# EAGLE design Shruthi-Analog-BlipToo12-v01 (EAGLE 5.09)
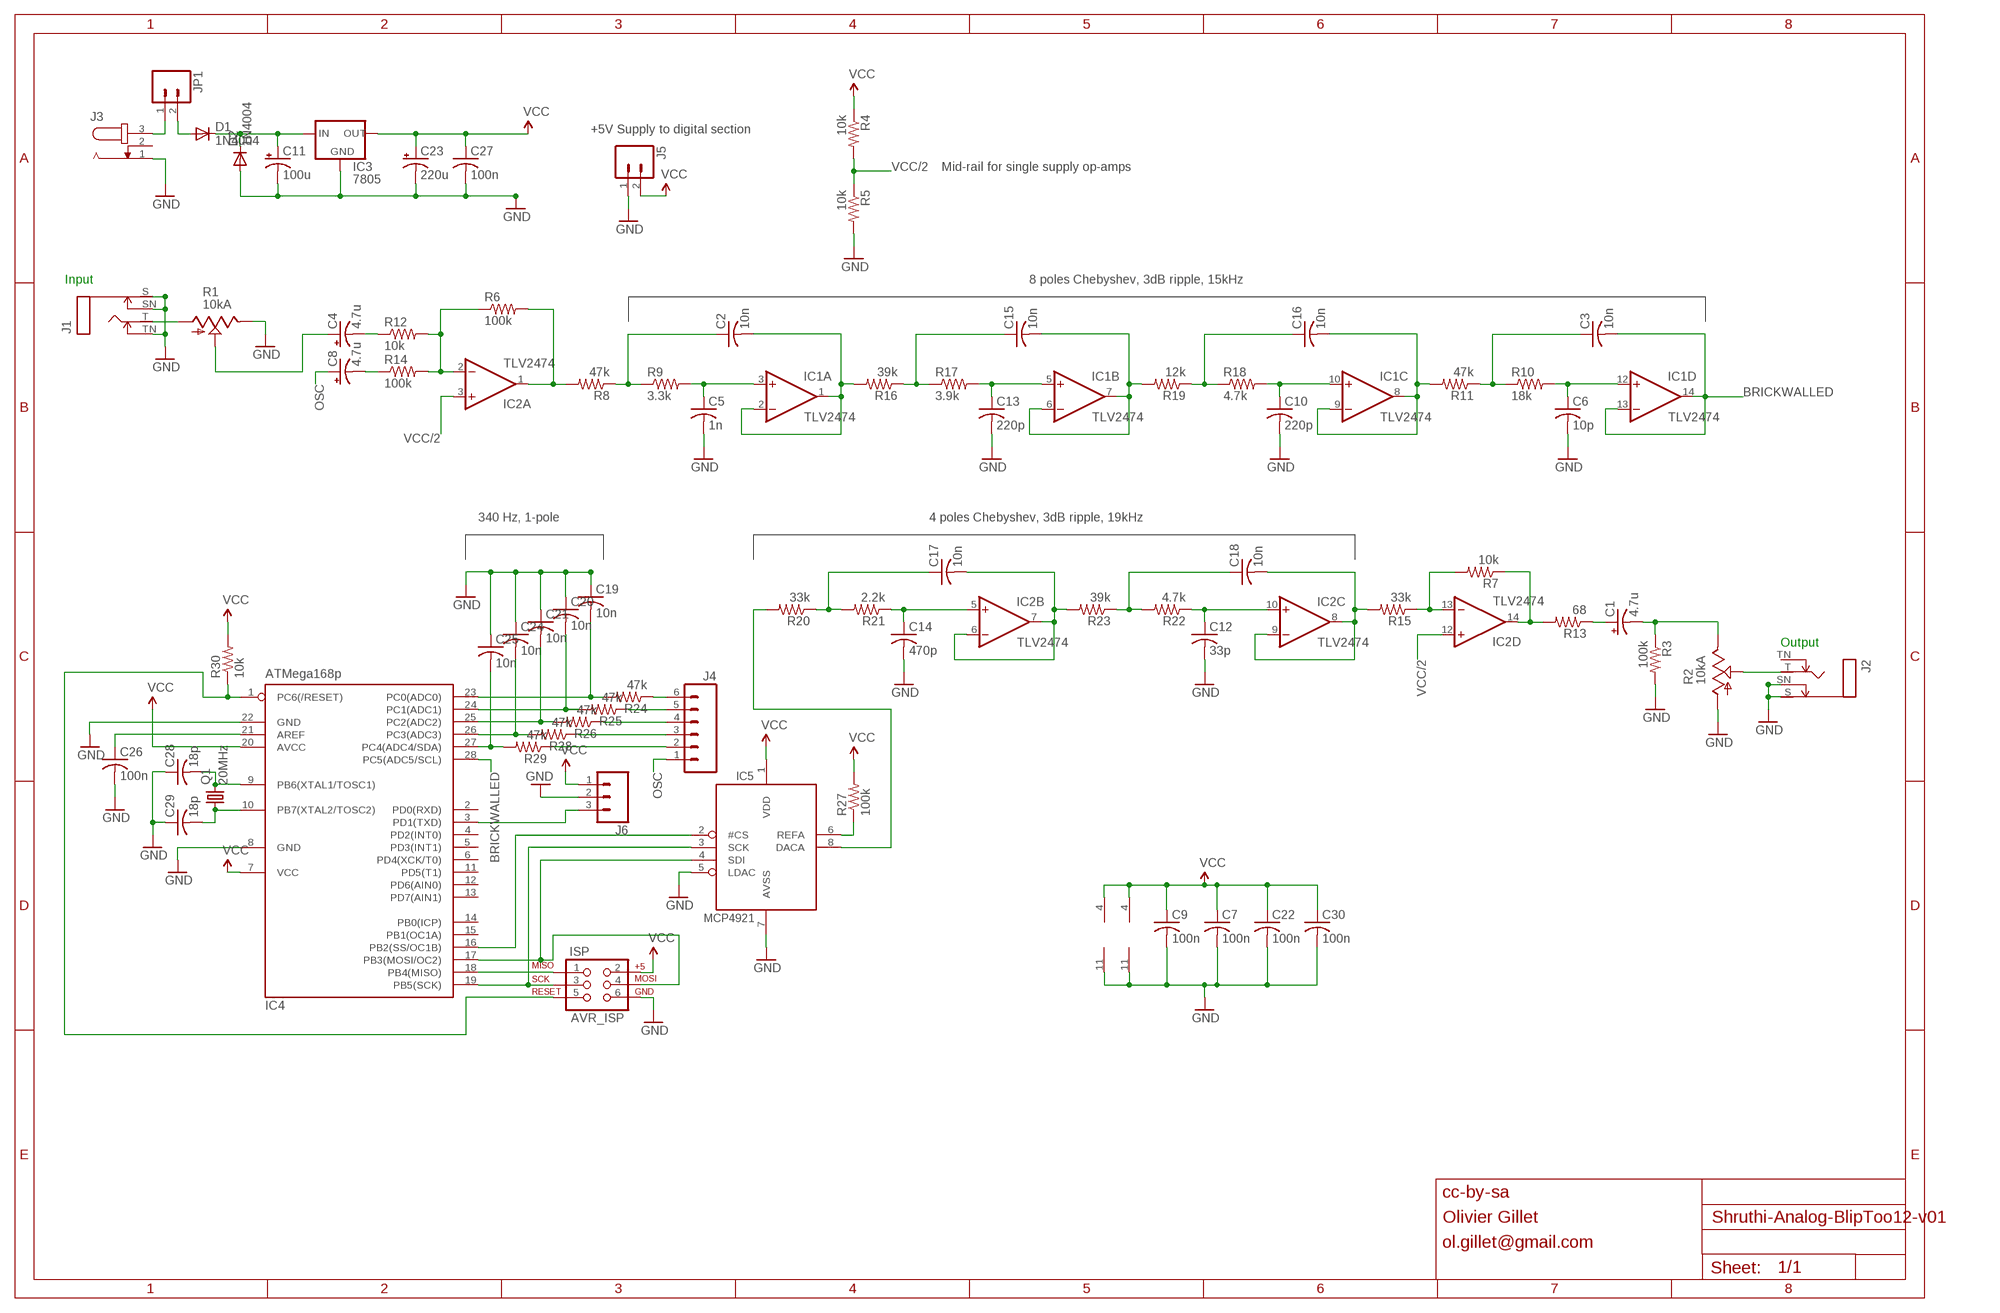
[diagram p0: schematic, sheet 1]

## Parts
C1  4.7u  CPOL-USE2.5-6  [E2,5-6]
C2  10n  C-US050-025X075  [C050-025X075]
C3  10n  C-US050-025X075  [C050-025X075]
C4  4.7u  CPOL-USE2.5-6  [E2,5-6]
C5  1n  C-US025-025X050  [C025-025X050]
C6  10p  C-US025-025X050  [C025-025X050]
C7  100n  C-US025-025X050  [C025-025X050]
C8  4.7u  CPOL-USE2.5-6  [E2,5-6]
C9  100n  C-US025-025X050  [C025-025X050]
C10  220p  C-US025-025X050  [C025-025X050]
C11  100u  CPOL-USE2.5-7  [E2,5-7]
C12  33p  C-US025-025X050  [C025-025X050]
C13  220p  C-US025-025X050  [C025-025X050]
C14  470p  C-US025-025X050  [C025-025X050]
C15  10n  C-US050-025X075  [C050-025X075]
C16  10n  C-US050-025X075  [C050-025X075]
C17  10n  C-US050-025X075  [C050-025X075]
C18  10n  C-US050-025X075  [C050-025X075]
C19  10n  C-US050-025X075  [C050-025X075]
C20  10n  C-US050-025X075  [C050-025X075]
C21  10n  C-US050-025X075  [C050-025X075]
C22  100n  C-US025-025X050  [C025-025X050]
C23  220u  CPOL-USE5-10.5  [E5-10,5]
C24  10n  C-US050-025X075  [C050-025X075]
C25  10n  C-US050-025X075  [C050-025X075]
C26  100n  C-US025-025X050  [C025-025X050]
C27  100n  C-US025-025X050  [C025-025X050]
C28  18p  C-US025-024X044  [C025-024X044]
C29  18p  C-US025-024X044  [C025-024X044]
C30  100n  C-US025-024X044  [C025-024X044]
D1  1N4004  [DO41-10]
D2  1N4004  [DO41-10]
IC1  TLV2474  TL084P  [DIL14]
IC2  TLV2474  TL084P  [DIL14]
IC3  7805  78XXS  [78XXS]
IC4  ATMega168p  MEGA8-P  [DIL28-3]
IC5  MCP4921  [DIL08]
ISP  AVR_ISP  AVR_SPI_PRG_6PTH  [2X3]
J1  MONOSWS  [NMJ4HC-S]
J2  MONOSWS  [NMJ4HC-S]
J3  JACK-PLUG  [SPC4078_LARGER_HOLES]
J4  M06SIP  [1X06]
J5  M02PTH  [1X02]
J6  M03PTH  [1X03]
JP1  M02  [1X02_LONGPADS]
Q1  20MHz  CRYSTALHC49U-V  [HC49U-V]
R1  10kA  POT_USCABLED  [CABLE_POT_6MM]
R2  10kA  POT_USCABLED  [CABLE_POT_6MM]
R3  100k  R-US_0204/7  [0204/7]
R4  10k  R-US_0204/7  [0204/7]
R5  10k  R-US_0204/7  [0204/7]
R6  100k  R-US_0204/7  [0204/7]
R7  10k  R-US_0204/7  [0204/7]
R8  47k  R-US_0204/7  [0204/7]
R9  3.3k  R-US_0204/7  [0204/7]
R10  18k  R-US_0204/7  [0204/7]
R11  47k  R-US_0204/7  [0204/7]
R12  10k  R-US_0204/7  [0204/7]
R13  68  R-US_0204/7  [0204/7]
R14  100k  R-US_0204/7  [0204/7]
R15  33k  R-US_0204/7  [0204/7]
R16  39k  R-US_0204/7  [0204/7]
R17  3.9k  R-US_0204/7  [0204/7]
R18  4.7k  R-US_0204/7  [0204/7]
R19  12k  R-US_0204/7  [0204/7]
R20  33k  R-US_0204/7  [0204/7]
R21  2.2k  R-US_0204/7  [0204/7]
R22  4.7k  R-US_0204/7  [0204/7]
R23  39k  R-US_0204/7  [0204/7]
R24  47k  R-US_0204/7  [0204/7]
R25  47k  R-US_0204/7  [0204/7]
R26  47k  R-US_0204/7  [0204/7]
R27  100k  R-US_0204/7  [0204/7]
R28  47k  R-US_0204/7  [0204/7]
R29  47k  R-US_0204/7  [0204/7]
R30  10k  R-US_0204/7  [0204/7]

## Nets
BRICKWALLED: C3.2 IC1.13(D:-IN) IC1.14(D:OUT) IC4.28(PC5(ADC5/SCL))
GND: C5.2 C6.2 C7.2 C9.2 C10.2 C11.- C12.2 C13.2 C14.2 C19.1 C20.1 C21.1 C22.2 C23.- C24.1 C25.1 C26.2 C27.2 C28.1 C29.1 C30.2 D2.A IC1.11(P:V-) IC2.11(P:V-) IC3.GND IC4.8(GND) IC4.22(GND) IC5.5(LDAC) IC5.7(AVSS) ISP.6 J1.S J1.SN J1.TN J2.S J2.SN J3.1 J5.1 J6.2 R1.E R2.A R3.2 R5.2
N$1: C5.1 IC1.3(A:+IN) R9.2
N$2: C2.1 R8.1 R9.1
N$3: J3.3 JP1.1
N$4: C11.+ D1.C D2.C IC3.IN
N$5: C2.2 IC1.1(A:OUT) IC1.2(A:-IN) R16.2
N$6: C13.1 IC1.5(B:+IN) R17.2
N$7: C15.1 R16.1 R17.1
N$8: C15.2 IC1.6(B:-IN) IC1.7(B:OUT) R19.2
N$9: C10.1 IC1.10(C:+IN) R18.2
N$10: C16.1 R18.1 R19.1
N$11: C16.2 IC1.8(C:OUT) IC1.9(C:-IN) R11.2
N$12: C6.1 IC1.12(D:+IN) R10.2
N$13: C3.1 R10.1 R11.1
N$14: IC4.1(PC6(/RESET)) ISP.5 R30.1
N$16: C26.1 IC4.21(AREF)
N$18: IC4.18(PB4(MISO)) ISP.1
N$19: IC4.19(PB5(SCK)) IC5.3(SCK) ISP.3
N$20: IC5.6(REFA) R27.1
N$21: C4.+ R1.S
N$22: IC4.17(PB3(MOSI/OC2)) IC5.4(SDI) ISP.4
N$23: J1.T R1.A
N$24: IC4.16(PB2(SS/OC1B)) IC5.2(#CS)
N$25: C17.1 R20.1 R21.2
N$26: C4.- R12.1
N$27: C14.1 IC2.5(B:+IN) R21.1
N$28: C17.2 IC2.6(B:-IN) IC2.7(B:OUT) R23.2
N$29: J4.2 R29.1
N$30: C18.1 R22.2 R23.1
N$31: C12.1 IC2.10(C:+IN) R22.1
N$32: C18.2 IC2.8(C:OUT) IC2.9(C:-IN) R15.2
N$33: IC5.8(DACA) R20.2
N$34: C1.- R2.E R3.1
N$35: C8.- R14.1
N$36: IC2.13(D:-IN) R7.2 R15.1
N$37: IC2.14(D:OUT) R7.1 R13.2
N$38: C1.+ R13.1
N$39: IC4.3(PD1(TXD)) J6.3
N$40: IC2.2(A:-IN) R6.1 R12.2 R14.2
N$41: J2.T R2.S
N$42: IC2.1(A:OUT) R6.2 R8.2
N$43: J4.3 R28.1
N$44: J4.4 R26.1
N$45: J4.5 R25.1
N$46: J4.6 R24.1
N$47: C25.2 IC4.27(PC4(ADC4/SDA)) R29.2
N$48: C24.2 IC4.26(PC3(ADC3)) R28.2
N$49: C21.2 IC4.25(PC2(ADC2)) R26.2
N$50: C20.2 IC4.24(PC1(ADC1)) R25.2
N$51: C19.2 IC4.23(PC0(ADC0)) R24.2
N$59: D1.A JP1.2
N$82: C29.2 IC4.10(PB7(XTAL2/TOSC2)) Q1.1
N$83: C28.2 IC4.9(PB6(XTAL1/TOSC1)) Q1.2
OSC: C8.+ J4.1
VCC: C7.1 C9.1 C22.1 C23.+ C27.1 C30.1 IC1.4(P:V+) IC2.4(P:V+) IC3.OUT IC4.7(VCC) IC4.20(AVCC) IC5.1(VDD) ISP.2 J5.2 J6.1 R4.1 R27.2 R30.2
VCC/2: IC2.3(A:+IN) IC2.12(D:+IN) R4.2 R5.1
Unconnected: IC4.2(PD0(RXD)) IC4.4(PD2(INT0)) IC4.5(PD3(INT1)) IC4.6(PD4(XCK/T0)) IC4.11(PD5(T1)) IC4.12(PD6(AIN0)) IC4.13(PD7(AIN1)) IC4.14(PB0(ICP)) IC4.15(PB1(OC1A)) J2.TN J3.2

## Notes on the sheet
- +5V Supply to digital section
- Mid-rail for single supply op-amps
- Input | 8 poles Chebyshev, 3dB ripple, 15kHz
- 340 Hz, 1-pole | 4 poles Chebyshev, 3dB ripple, 19kHz
- Output
- cc-by-sa
- Olivier Gillet
- ol.gillet@gmail.com

## Library data of the parts
C1 C4 C8 C11 C23 = rcl:CPOL-US: POLARIZED CAPACITOR, American symbol
C2 C3 C5-C7 C9 C10 C12-C22 C24-C30 = rcl:C-US: CAPACITOR, American symbol
D1 D2 = diode:1N4004: DIODE general purpose rectifier, 1 A
IC1 IC2 = linear:TL084: OP AMP
IC3 = v-reg:78XXS: VOLTAGE REGULATOR
IC4 = atmel:MEGA8-P: MICROCONTROLLER 8 Kbytes FLASH, 1 kbytes SRAM, 512 bytes EEPROM, USART, 4-channel 10 bit ADC, 2-channel 8 bit ADC Pin compatible with Atmega48, ATMega88, ATMega168 Source: avr.lbr
IC5 = adafruit:MCP4921
ISP = SparkFun:AVR_SPI_PRG_6: AVR ISP 6 Pin This is the reduced ISP connector for AVR programming. Common on Arduino. This footprint will take up less PCB space and can be used with a 10-pin to 6-pin adapter such as SKU: BOB-08508
J1 J2 = gm-jacks:MONOSW
J3 = con-jack2:JACK-PLUG: DC POWER JACK Power Jack, DC, Right Angle, Through Hole, Rated 5A at 16VDC, PC Terminals Distributor: Farnell (www.Farnell.de) Drawing: 84N1161.pdf / 84N1162.pdf Manufacturer: SPC Technology (www.spctechnology.com) Type: SPC4077 / SPC 4078
J4 = SparkFun:M06: Header 6 Standard 6-pin 0.1" header. Use with straight break away headers (SKU : PRT-00116), right angle break away headers (PRT-00553), swiss pins (PRT-00743), machine pins (PRT-00117), and female headers (PRT-00115). Molex polarized connector foot print use with SKU : PRT-08094 with associated crimp pins and housings. NOTES ON THE VARIANTS LOCK and LOCK_LONGPADS... This footprint was designed to help hold the alignment of a through-hole component (i.e. 6-pin header) while soldering it into place. You may notice that each hole has been shifted either up or down by 0.005 of an inch from it's more standard position (which is a perfectly straight line). This slight alteration caused the pins (the squares in the middle) to touch the edges of the holes. Because they are alternating, it causes a "brace" to hold the component in place. 0.005 has proven to be the perfect amount of "off-center" position when using our standard breakaway headers. Although looks a little odd when you look at the bare footprint, once you have a header in there, the alteration is very hard to notice. Also, if you push a header all the way into place, it is covered up entirely on the bottom side. This idea of altering the position of holes to aid alignment will be further integrated into the Sparkfun Library for other footprints. It can help hold any component with 3 or more connection pins.
J5 JP1 = SparkFun:M02: Header 2 Standard 2-pin 0.1" header. Use with straight break away headers (SKU : PRT-00116), right angle break away headers (PRT-00553), swiss pins (PRT-00743), machine pins (PRT-00117), and female headers (PRT-00115). Molex polarized connector foot print use with SKU : PRT-08233 with associated crimp pins and housings.
J6 = SparkFun:M03: Header 3 Standard 3-pin 0.1" header. Use with straight break away headers (SKU : PRT-00116), right angle break away headers (PRT-00553), swiss pins (PRT-00743), machine pins (PRT-00117), and female headers (PRT-00115). Molex polarized connector foot print use with SKU : PRT-08232 with associated crimp pins and housings.
Q1 = crystal:CRYSTAL: CRYSTAL
R1 R2 = pot-cable:POT_US
R3-R30 = rcl:R-US_: RESISTOR, American symbol

## Board
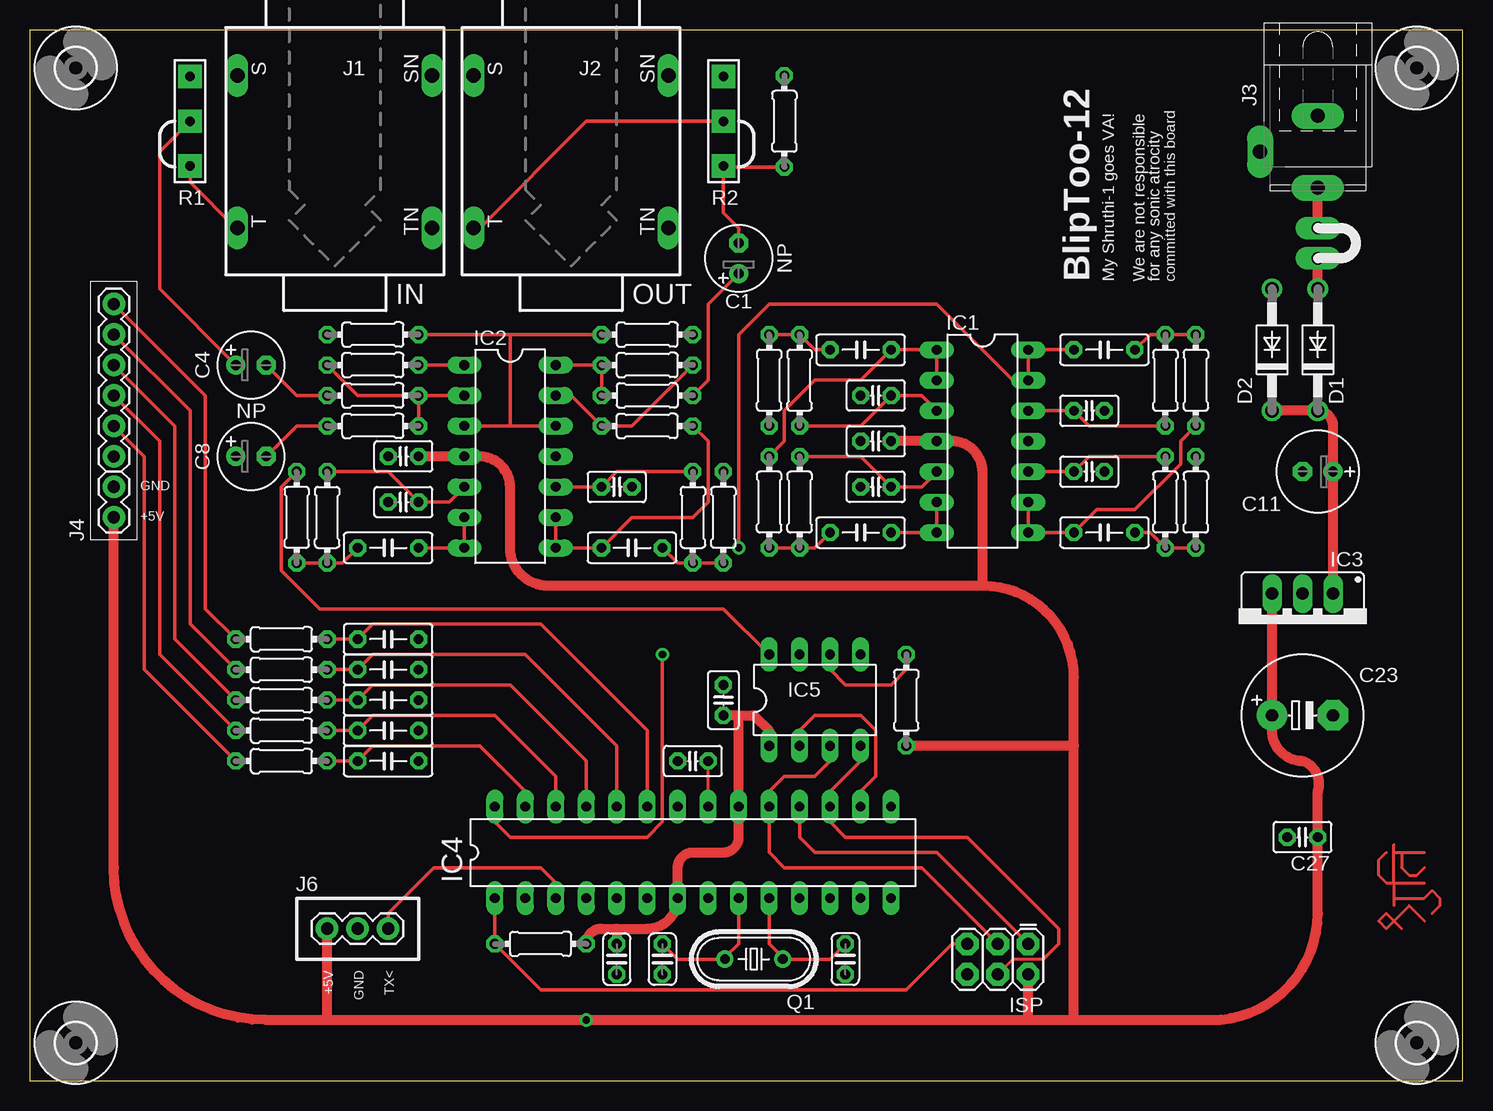
[diagram p1: board, top side]
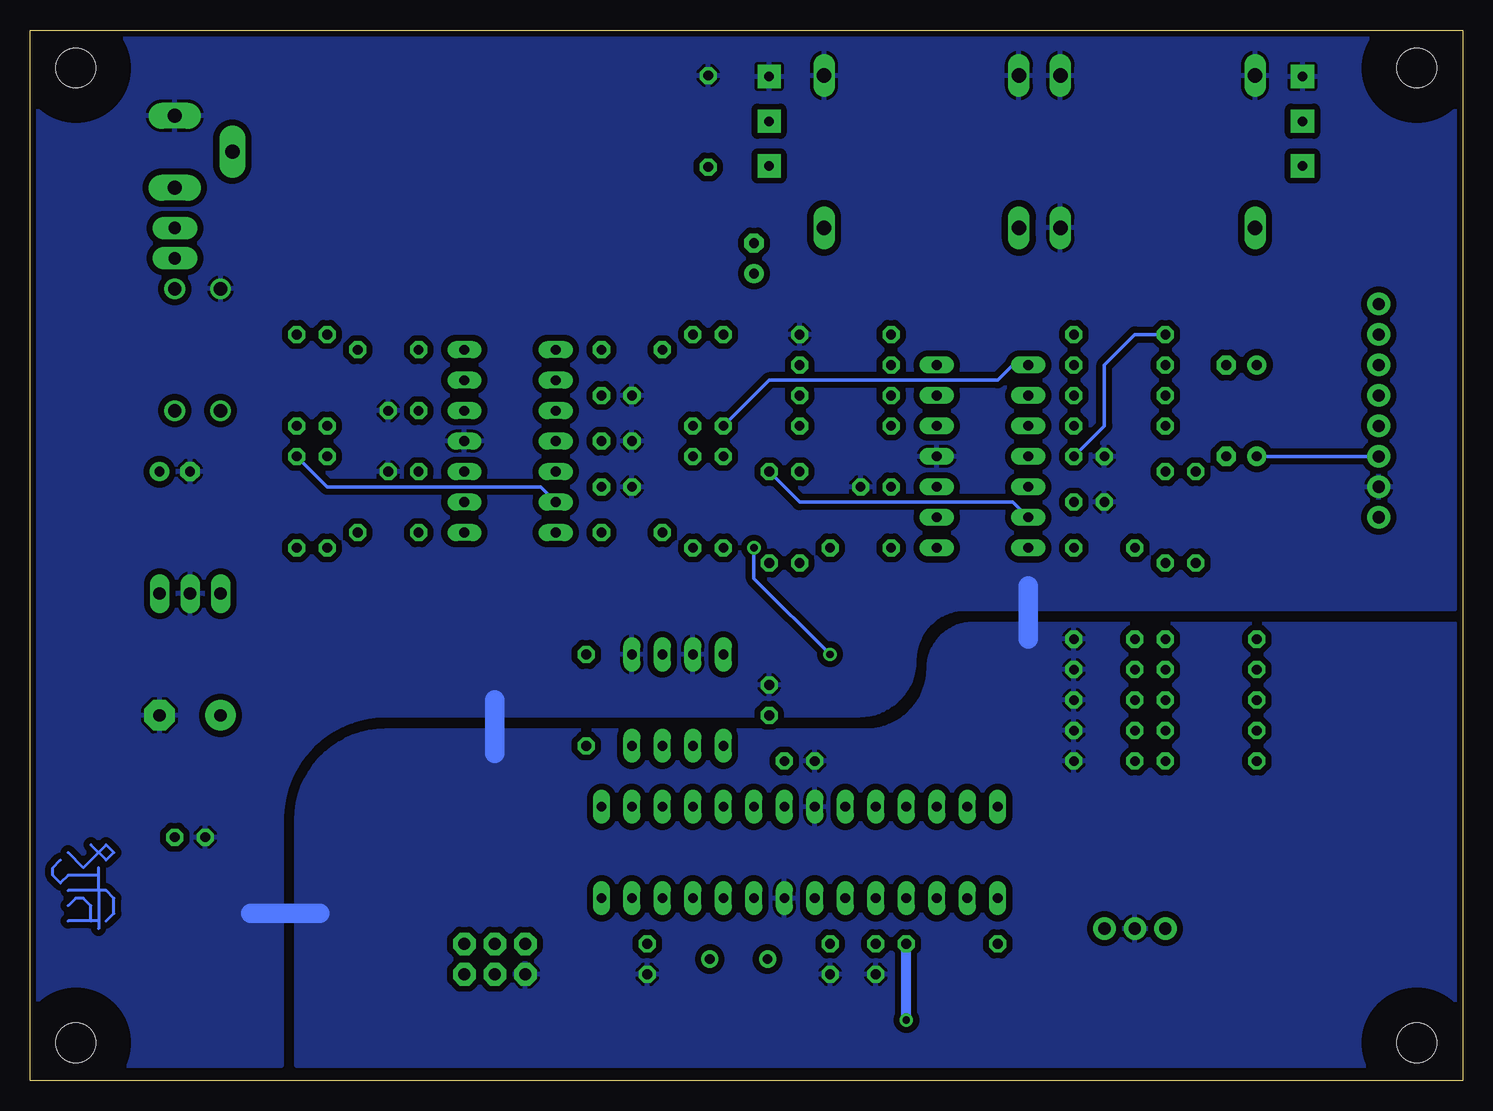
[diagram p2: board, bottom side, seen from below]

Size 119.38 x 87.62 mm. Coordinates in mm from the lower left corner, seen from the top.
Outline: 0,0 119.38,0 119.38,87.62 0,87.62 0,0
Copper layers (1*16): Top 0.035mm / dielectric 1.5mm / Bottom 0.035mm
Design rules "SparkFun": minimum track width 8mil, minimum drill 20mil, track to track 8mil, track to pad 8mil, pad to pad 8mil, via to via 8mil, smd to smd 8mil, copper to edge 10mil, drill to drill 8mil, minimum pad ring 12mil, minimum via ring 10mil, stop-mask expansion 4mil, vias tented up to drill 25mil, thermal gap 10mil

### Footprints (pad centres in the part's own frame; a part is rotated, then mirrored left to right if it is on the bottom)
E2,5-6 = drill 0.813 pad 1.6 round: + -1.27,0 | drill 0.813 pad 1.6 octagon: - 1.27,0
C050-025X075 = drill 0.813 octagon: 1 -2.54,0; 2 2.54,0
C025-025X050 = drill 0.813 octagon: 1 -1.27,0; 2 1.27,0
E2,5-7 = drill 0.813 pad 1.6 round: + -1.27,0 | drill 0.813 pad 1.6 octagon: - 1.27,0
E5-10,5 = drill 1.016 pad 2.54 round: + -2.54,0 | drill 1.016 pad 2.54 octagon: - 2.54,0
C025-024X044 = drill 0.813 octagon: 1 -1.27,0; 2 1.27,0
DO41-10 = drill 1.118 round: A 5.08,0; C -5.08,0
DIL14 = drill 0.813 long: 1 -7.62,-3.81; 2 -5.08,-3.81; 3 -2.54,-3.81; 4 0,-3.81; 5 2.54,-3.81; 6 5.08,-3.81; 7 7.62,-3.81; 8 7.62,3.81; 9 5.08,3.81; 10 2.54,3.81; 11 0,3.81; 12 -2.54,3.81; 13 -5.08,3.81; 14 -7.62,3.81
78XXS = drill 1.016 long: GND 0,-2.54; IN -2.54,-2.54; OUT 2.54,-2.54
DIL28-3 = drill 0.813 long: 1 -16.51,-3.81; 2 -13.97,-3.81; 3 -11.43,-3.81; 4 -8.89,-3.81; 5 -6.35,-3.81; 6 -3.81,-3.81; 7 -1.27,-3.81; 8 1.27,-3.81; 9 3.81,-3.81; 10 6.35,-3.81; 11 8.89,-3.81; 12 11.43,-3.81; 13 13.97,-3.81; 14 16.51,-3.81; 15 16.51,3.81; 16 13.97,3.81; 17 11.43,3.81; 18 8.89,3.81; 19 6.35,3.81; 20 3.81,3.81; 21 1.27,3.81; 22 -1.27,3.81; 23 -3.81,3.81; 24 -6.35,3.81; 25 -8.89,3.81; 26 -11.43,3.81; 27 -13.97,3.81; 28 -16.51,3.81
DIL08 = drill 0.813 long: 1 -3.81,-3.81; 2 -1.27,-3.81; 3 1.27,-3.81; 4 3.81,-3.81; 5 3.81,3.81; 6 1.27,3.81; 7 -1.27,3.81; 8 -3.81,3.81
2X3 = drill 1.016 pad 1.88 octagon: 1 0,0; 2 0,2.54; 3 2.54,0; 4 2.54,2.54; 5 5.08,0; 6 5.08,2.54
NMJ4HC-S = drill 1.2 long: S 5.08,8.115; SN 5.08,-8.115; T -7.62,8.115; TN -7.62,-8.115
SPC4078_LARGER_HOLES = drill 1.2 pad 2.184 long: 1 -3,0; 2 0,-4.8; 3 3,0
1X06 = drill 1.016 pad 1.88 round: 1 0,0; 2 2.54,0; 3 5.08,0; 4 7.62,0; 5 10.16,0; 6 12.7,0
1X02 = drill 1.016 pad 1.88 round: 1 0,0; 2 2.54,0
1X03 = drill 1.016 pad 1.88 round: 1 0,0; 2 2.54,0; 3 5.08,0
1X02_LONGPADS = drill 1.016 pad 1.88 long: 1 0,0; 2 2.54,0
HC49U-V = drill 0.813 round: 1 -2.413,0; 2 2.413,0
CABLE_POT_6MM = drill 0.8 pad 1.93 square: A -3.73,0; E 3.73,0; S 0,0
0204/7 = drill 0.813 octagon: 1 -3.81,0; 2 3.81,0
3,3 = hole 3.3: 0,0

### Placement (x,y rotation side)
C1  59.05,68.58 90 top
C2  69.22,60.96 0 top
C3  89.53,60.96 180 top
C4  18.41,59.69 0 top
C5  70.48,57.15 180 top
C6  88.27,55.88 0 top
C7  70.48,53.34 180 top
C8  18.41,52.07 0 top
C9  31.11,52.07 180 top
C10  88.27,50.8 0 top
C11  107.31,50.8 180 top
C12  48.89,49.53 0 top
C13  70.48,49.53 180 top
C14  31.11,48.26 180 top
C15  69.22,45.72 0 top
C16  89.53,45.72 180 top
C17  29.84,44.45 0 top
C18  50.16,44.45 180 top
C19  29.84,36.83 180 top
C20  29.84,34.29 180 top
C21  29.84,31.75 180 top
C22  57.78,31.75 90 top
C23  106.05,30.48 0 top
C24  29.84,29.21 180 top
C25  29.84,26.67 180 top
C26  55.24,26.67 180 top
C27  106.05,20.32 180 top
C28  52.7,10.16 90 top
C29  67.95,10.16 90 top
C30  48.89,10.16 270 top
D1  107.31,60.96 90 top
D2  103.5,60.96 90 top
IC1  79.38,53.34 270 top
IC2  40.01,52.07 270 top
IC3  106.05,38.1 180 top
IC4  55.24,19.05 0 top
IC5  65.41,31.75 0 top
ISP  83.19,11.43 180 top
J1  25.4,78.74 90 top
J2  45.09,78.74 90 top
J3  107.31,77.47 270 top
J4  6.99,52.07 90 top
J5  6.99,49.53 270 top
J6  24.77,12.7 0 top
JP1  107.31,71.12 270 top
Q1  60.33,10.16 180 top
R1  13.34,80.01 90 top
R2  57.78,80.01 270 top
R3  62.87,80.01 90 top
R4  28.57,62.23 0 top
R5  51.44,62.23 0 top
R6  28.57,59.69 0 top
R7  51.44,59.69 0 top
R8  61.59,58.42 270 top
R9  64.14,58.42 270 top
R10  94.61,58.42 270 top
R11  97.16,58.42 270 top
R12  28.57,57.15 0 top
R13  51.44,57.15 180 top
R14  28.57,54.61 0 top
R15  51.44,54.61 0 top
R16  61.59,48.26 90 top
R17  64.14,48.26 90 top
R18  94.61,48.26 90 top
R19  97.16,48.26 90 top
R20  22.23,46.99 90 top
R21  24.77,46.99 270 top
R22  55.24,46.99 270 top
R23  57.78,46.99 90 top
R24  20.96,36.83 0 top
R25  20.96,34.29 0 top
R26  20.96,31.75 0 top
R27  73.03,31.75 270 top
R28  20.96,29.21 0 top
R29  20.96,26.67 0 top
R30  42.55,11.43 0 top
U$1  [3,3]  3.81,84.46 0 top
U$2  [3,3]  115.57,84.46 0 top
U$3  [RANGOLI]  65.41,66.68 0 top
U$4  [3,3]  3.81,3.17 0 top
U$5  [3,3]  115.57,3.17 0 top

### Tracks (layer width: path | path; a pad name or v marks a point on that pad's centre or on a via)
BRICKWALLED  (via drill 0.6)
  Top 0.305: C3.2 IC1.14 IC1.13 81.92,58.42 75.56,64.77 61.59,64.77 59.05,62.23 v59.05,44.45 | IC4.28 38.73,21.59 40.01,20.32 51.44,20.32 52.7,21.59 v52.7,35.56
  Bottom 0.305: v52.7,35.56 59.05,41.91 v59.05,44.45
GND
  Bottom 1.626: 36.2,36.83 36.2,41.27 | 80.64,27.3 80.64,31.75 | 95.25,13.97 100.97,13.97
  pour Bottom (isolate 0.508): 0.64,87 0.64,39.37 41.41,39.37 arc-90 45.72,35.06 arc90 50.3,30.48 89.4,30.48 arc-90 98.42,22.09 98.42,1.27 111.12,1.27 118.75,0.64 118.75,87
  pour Bottom (isolate 0.508): 0.64,38.1 0.64,1.27 97.16,1.27 97.16,21.8 arc90 89.75,29.21 49.69,29.21 arc-90 44.45,34.45 arc90 40.8,38.1
N$1
  Top 0.305: IC1.3 74.3,57.15 C5.1 69.22,54.61 R9.2
N$2
  Top 0.305: R8.1 R9.1 65.41,60.96 C2.1
N$3
  Top 0.813: JP1.1 J3.3
N$4
  Top 0.813: IC3.IN C11.+ 108.58,54.61 arc90 D1.C D2.C
N$5
  Top 0.305: IC1.2 IC1.1 C2.2 69.22,58.42 65.41,58.42 62.87,55.88 62.87,53.34 R16.2
N$6
  Top 0.305: R17.2 69.22,52.07 C13.1 74.3,49.53 IC1.5
N$7
  Top 0.305: C15.1 65.41,44.45 R17.1 R16.1
N$8
  Top 0.305: IC1.6 IC1.7 C15.2
  Bottom 0.305: IC1.6 76.83,49.53 94.61,49.53 R19.2
N$9
  Top 0.305: R18.2 88.27,52.07 C10.1 IC1.10
N$10
  Top 0.305: C16.1 93.34,45.72 R18.1 R19.1
N$11
  Top 0.305: IC1.9 IC1.8 C16.2 88.9,47.62 92.08,47.62 95.89,51.44 95.89,53.34 R11.2
N$12
  Top 0.305: R10.2 88.27,54.61 C6.1 IC1.12
N$13
  Top 0.305: C3.1 93.34,62.23 R10.1 R11.1
N$14
  Top 0.305: IC4.1 R30.1 42.55,7.62 73.03,7.62 76.83,11.43 ISP.5
N$15
  Bottom 0.254: 116.2,19.05 114.94,17.78 113.03,19.68 112.39,19.05 113.03,18.41 114.3,19.68
N$16
  Top 0.254: IC4.21 C26.1
N$18
  Top 0.305: IC4.18 64.14,20.32 65.41,19.05 75.56,19.05 ISP.1
N$19
  Top 0.305: IC5.3 66.67,26.67 65.41,25.4 62.87,25.4 61.59,24.13 IC4.19 61.59,19.05 62.87,17.78 74.3,17.78 ISP.3
N$20
  Top 0.305: IC5.6 66.67,34.29 67.95,33.02 71.75,33.02 73.03,34.29 R27.1
N$21
  Top 0.305: R1.S 10.79,77.47 10.79,66.04 C4.+
N$22
  Top 0.254: 84.45,10.16 81.92,10.16 ISP.4
  Top 0.305: IC5.4 69.22,26.67 66.67,24.13 IC4.17 66.67,21.59 67.95,20.32 78.11,20.32 85.72,12.7 85.72,11.43 84.45,10.16
N$23
  Top 0.305: R1.A 13.34,74.93 17.14,71.12 J1.T
N$24
  Top 0.305: IC5.2 64.14,29.21 65.41,30.48 69.22,30.48 70.48,29.21 70.48,25.4 69.22,24.13 IC4.16
N$25
  Top 0.305: R20.1 R21.2 26.04,43.18 C17.1
N$26
  Top 0.305: C4.- 22.23,57.15 R12.1
N$27
  Top 0.305: IC2.5 34.93,48.26 C14.1 29.84,50.8 R21.1
N$28
  Top 0.305: IC2.6 IC2.7 C17.2
  Bottom 0.305: IC2.6 37.47,48.26 55.24,48.26 R23.2
N$29
  Top 0.305: J4.2 9.53,52.07 9.53,34.29 R29.1
N$30
  Top 0.305: C18.1 53.98,43.18 R22.2 R23.1
N$31
  Top 0.305: IC2.10 C12.1 48.89,50.8 R22.1
N$32
  Top 0.305: IC2.9 IC2.8 C18.2 50.16,46.99 55.24,46.99 56.52,48.26 56.52,53.34 R15.2
N$33
  Top 0.305: IC5.8 57.78,39.37 24.13,39.37 20.96,42.55 20.96,49.53 R20.2
N$34
  Top 0.305: 57.87,76.2 R2.E | 57.87,76.2 57.78,76.12 57.78,72.39 59.05,71.12 C1.- | 57.87,76.2 R3.1
N$35
  Top 0.305: C8.- 22.23,54.61 R14.1
N$36
  Top 0.305: IC2.13 45.09,57.15 R15.1 50.16,54.61 R7.2
N$37
  Top 0.305: R13.2 R7.1 IC2.14
N$38
  Top 0.305: R13.1 56.52,58.42 56.52,64.77 C1.+
N$39
  Top 0.305: IC4.3 43.81,16.51 42.55,17.78 33.66,17.78 29.84,13.97 J6.3
N$40
  Top 0.305: R6.1 27.3,57.15 R12.2 | R12.2 R14.2 | R12.2 IC2.2
N$41
  Top 0.305: R2.S 46.35,80.01 37.47,71.12 J2.T
N$42
  Top 0.305: R6.2 IC2.1
  Bottom 0.305: IC2.1 37.47,59.69 38.73,58.42 57.78,58.42 R8.2
N$43
  Top 0.305: J4.3 10.79,53.34 10.79,35.56 R28.1
N$44
  Top 0.305: J4.4 12.07,54.61 12.07,36.83 R26.1
N$45
  Top 0.305: J4.5 13.34,55.88 13.34,38.1 R25.1
N$46
  Top 0.305: J4.6 14.61,57.15 14.61,39.37 R24.1
N$47
  Top 0.305: R29.2 C25.2 28.57,27.94 37.47,27.94 41.27,24.13 IC4.27
N$48
  Top 0.305: R28.2 C24.2 28.57,30.48 38.73,30.48 43.81,25.4 IC4.26
N$49
  Top 0.305: R26.2 C21.2 28.57,33.02 40.01,33.02 46.35,26.67 IC4.25
N$50
  Top 0.305: R25.2 C20.2 28.57,35.56 41.27,35.56 48.89,27.94 IC4.24
N$51
  Top 0.305: R24.2 C19.2 28.57,38.1 42.55,38.1 51.44,29.21 IC4.23
N$52
  Bottom 0.254: 113.67,17.14 113.67,17.78 | 113.67,15.88 113.67,17.14 | 113.67,15.88 113.67,13.34 | 113.67,13.34 113.67,12.7 | 114.3,13.34 116.2,13.34 | 113.67,13.34 114.3,13.34 | 114.3,13.34 114.3,14.61 114.94,15.24 115.57,15.24 116.2,14.61 | 113.67,17.14 116.2,17.14 116.84,16.51 117.47,17.14 117.47,17.78 116.84,18.41 | 113.67,15.88 116.2,15.88 | 113.67,15.88 113.03,15.88 112.39,15.24 112.39,13.97 113.03,13.34
N$53
  Top 0.254: 116.2,13.34 114.94,14.61 113.03,12.7 112.39,13.34 113.03,13.97 114.3,12.7
N$54
  Top 0.254: 113.67,15.24 113.67,14.61 | 113.67,16.51 113.67,15.24 | 113.67,16.51 113.67,19.05 | 113.67,19.05 113.67,19.68 | 114.3,19.05 116.2,19.05 | 113.67,19.05 114.3,19.05 | 114.3,19.05 114.3,17.78 114.94,17.14 115.57,17.14 116.2,17.78 | 113.67,15.24 116.2,15.24 116.84,15.88 117.47,15.24 117.47,14.61 116.84,13.97 | 113.67,16.51 116.2,16.51 | 113.67,16.51 113.03,16.51 112.39,17.14 112.39,18.41 113.03,19.05
N$59
  Top 0.813: D1.A JP1.2
N$82
  Top 0.305: IC4.10 61.59,11.43 62.74,10.29 Q1.1 66.67,10.16 C29.2
N$83
  Top 0.305: IC4.9 59.05,11.43 57.91,10.29 Q1.2 53.98,10.16 C28.2
OSC
  Bottom 0.305: J4.1 C8.+
VCC  (via drill 0.6)
  Top 0.305: IC4.7 53.98,13.97
  Top 0.813: J5.2 6.99,17.78 arc90 19.68,5.08 24.77,5.08 | 24.77,5.08 v46.35,5.08 83.19,5.08 | 83.19,5.08 87,5.08 | 87,5.08 98.42,5.08 arc90 107.31,13.97 C27.1 107.31,24.13 arc90 106.05,26.67 arc-90 103.5,29.21 C23.+ IC3.OUT | 87,5.08 87,27.94 | 87,27.94 87,33.66 arc90 79.38,41.27 | 79.38,41.27 43.18,41.27 arc-90 40.01,44.45 40.01,49.53 arc90 37.47,52.07 IC2.4 C9.1 | 79.38,41.27 79.38,50.8 arc90 76.83,53.34 IC1.4 C7.1 | 87,27.94 R27.2 | 83.19,5.08 ISP.2 | R30.2 arc-90 47.62,12.7 48.89,12.7 | 48.89,12.7 51.44,12.7 arc90 IC4.7 53.98,17.78 arc-90 55.24,19.05 57.78,19.05 arc90 59.05,20.32 IC4.20 59.05,30.48 | IC5.1 61.59,29.21 60.33,30.48 59.05,30.48 | 24.77,5.08 J6.1 | 59.05,30.48 C22.1 | 48.89,12.7 C30.1
  Bottom 0.305: R4.1 27.3,62.23 29.84,59.69 29.84,54.61 C9.1
  Bottom 0.813: v46.35,5.08 R30.2
VCC/2
  Top 0.305: 40.01,62.23 R4.2 | 40.01,62.23 R5.1 | 40.01,54.61 IC2.12 | 40.01,54.61 40.01,62.23 | IC2.3 40.01,54.61

### Text on the board
tPlace: GND | +5V | +5V | GND | TX<
tNames: NP | BlipToo-12 | My Shruthi-1 goes VA! | We are not responsible | for any sonic atrocity | committed with this board | IN | OUT | NP